# Altium schematic sheet 5_MOTORES_DE_PASSO.SchDoc
size Tabloid; SheetNumber: 5; SheetTotal: 5; SPICEModelCacheVFRLFGQA: <root> / <DocumentId>VFRLFGQA</DocumentId> / <CacheFrame Number="0"> / <Model Name="0603_885012206121_330nf" Kind="CKT"> / <Text>******* / .subckt 0603_885012206121_330nF 1 2 / Rser 1 3 0.0116331902783 / Lser 2 4 2.98906197E-10 / C1 3 4 0.00000033 / Rpar 3 4 1500000000 / .ends 0603_885012206121_330nF</Text> / </Model> / <Model Name="865080645012_47uf" Kind="CKT"> / <Text>******* / .subckt 865080645012_47uF 1 2 / Rser 1 3 0.49 / Lser 2 4 0.000000002503 / C1 3 4 0.000047 / Rpar 3 4 2127659.57446809 / .ends 865080645012_47uF</Text> / </Model> / </CacheFrame> / </root>
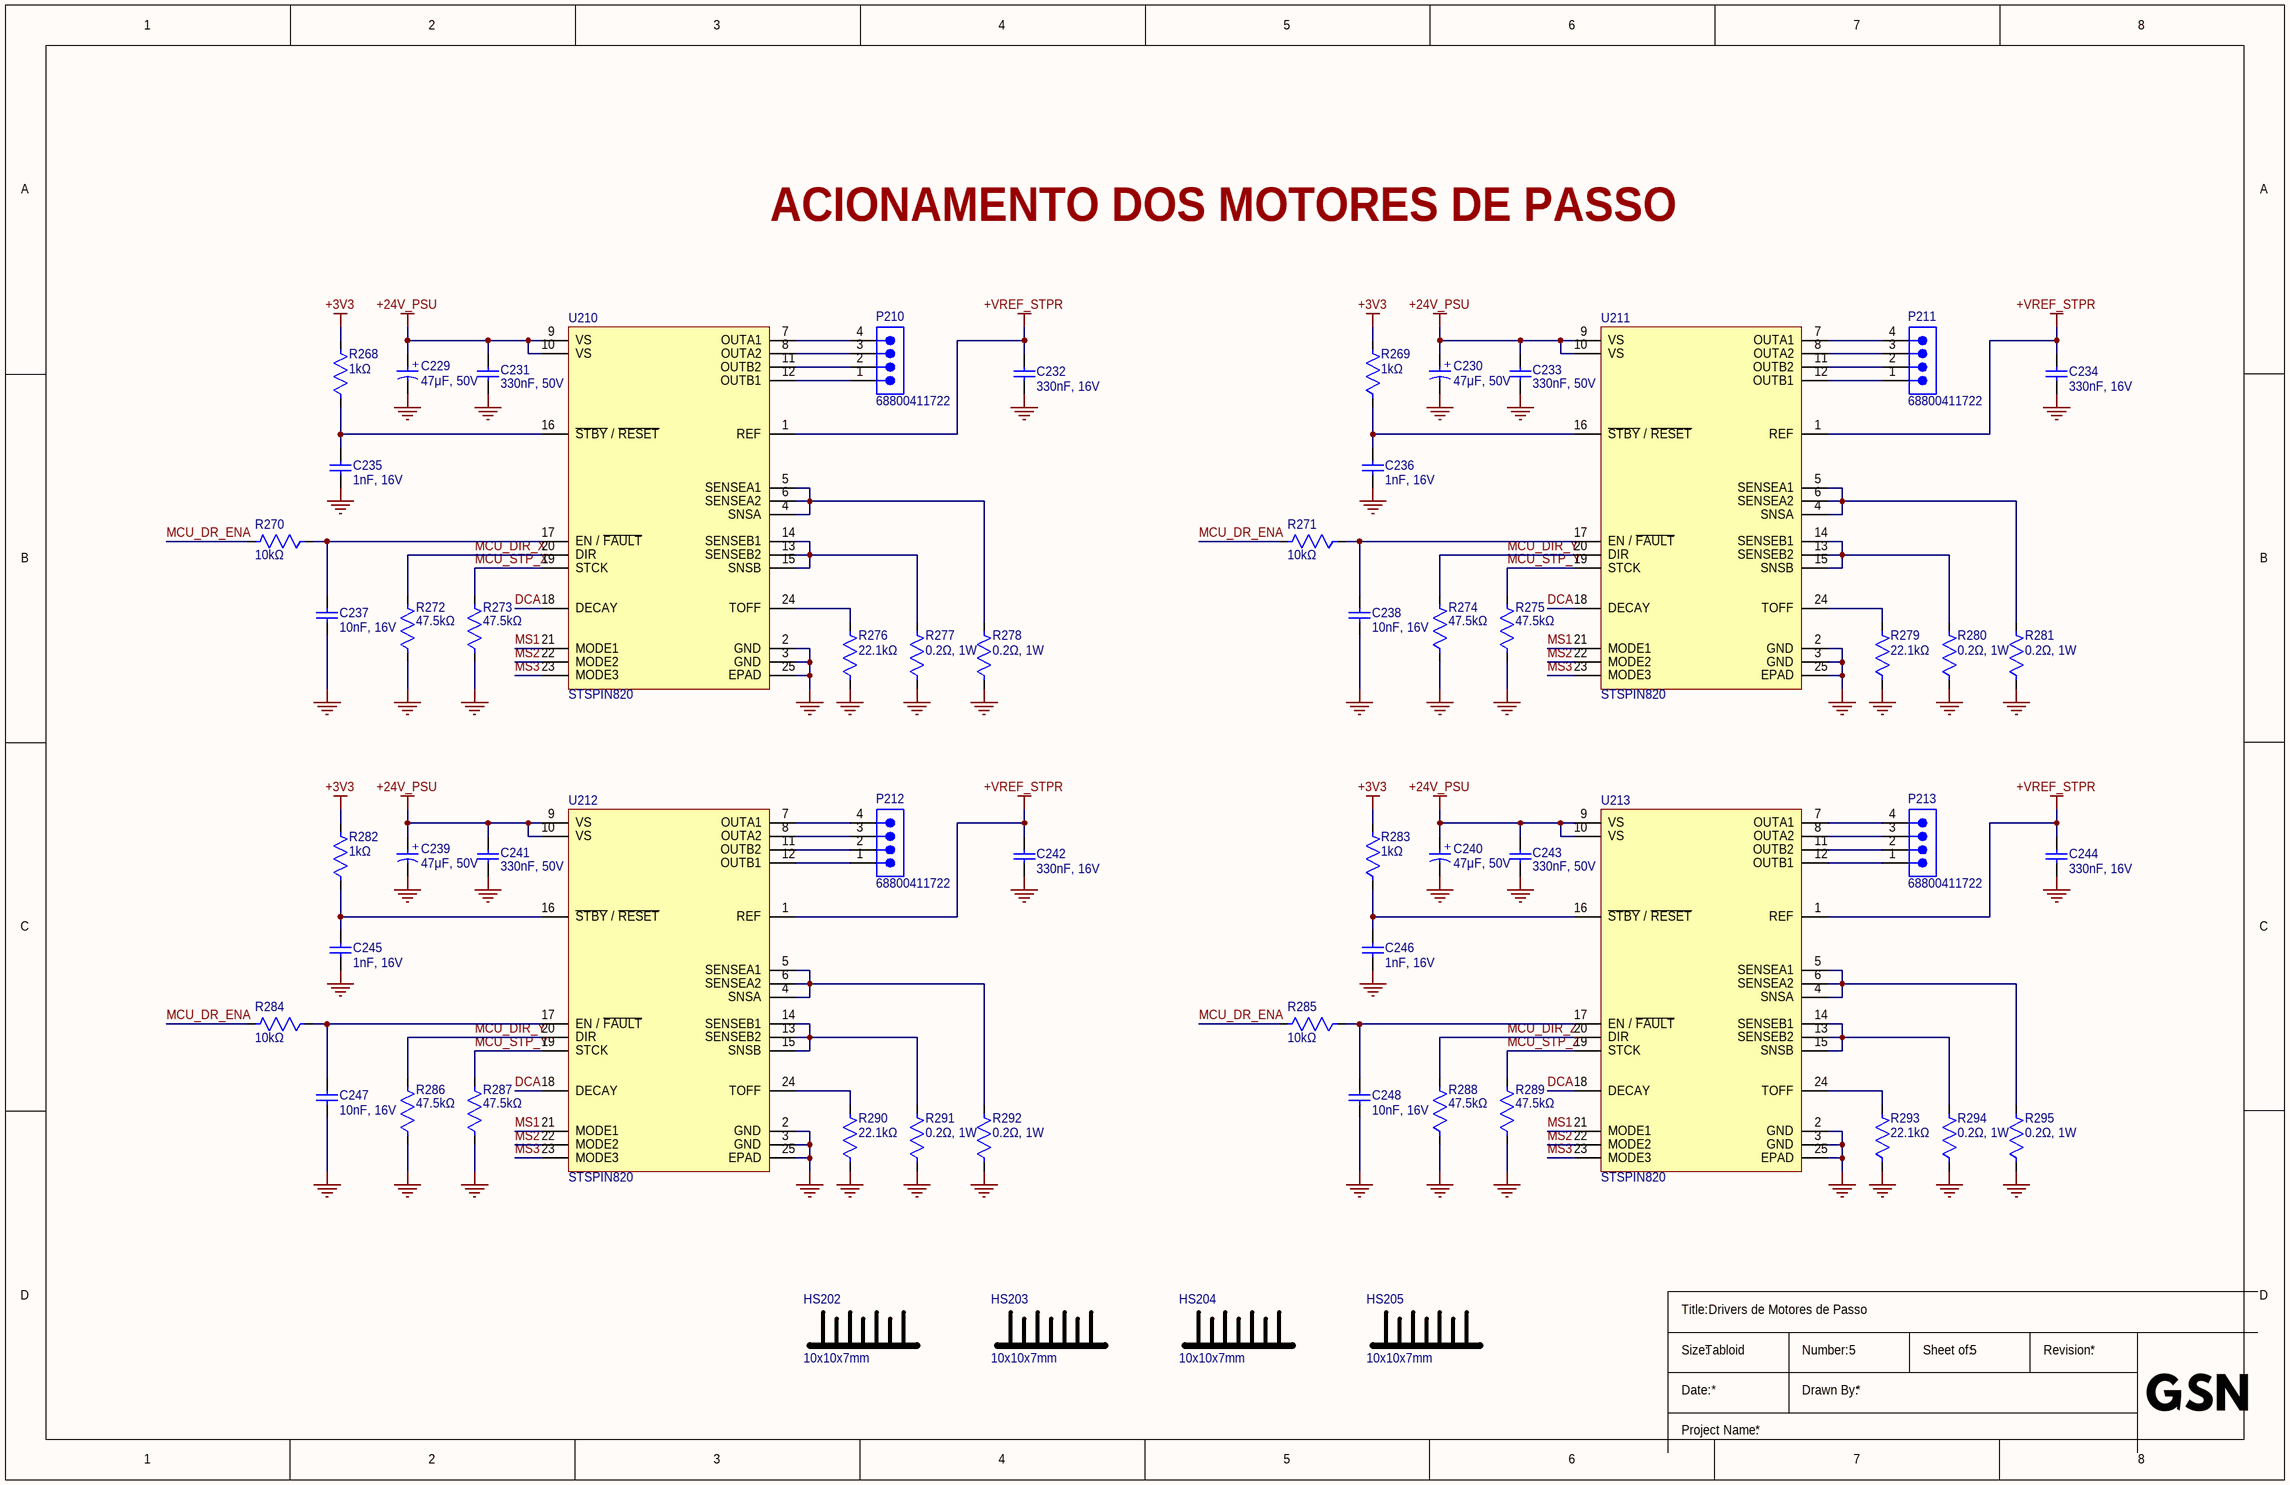
[diagram p0: 5_MOTORES_DE_PASSO.SchDoc]

## Parts
C229  47μF, 50V  [WCAP-ASLI_D6.3H7.7]
C230  47μF, 50V  [WCAP-ASLI_D6.3H7.7]
C231  330nF, 50V  [WCAP-CSGP_0603_L1.6W0.8H0.8_Wave]
C232  330nF, 16V  [WCAP-CSGP_0603_L1.6W0.8H0.8_Wave]
C233  330nF, 50V  [WCAP-CSGP_0603_L1.6W0.8H0.8_Wave]
C234  330nF, 16V  [WCAP-CSGP_0603_L1.6W0.8H0.8_Wave]
C235  1nF, 16V  [WCAP-CSGP_0603_L1.6W0.8H0.8_Wave]
C236  1nF, 16V  [WCAP-CSGP_0603_L1.6W0.8H0.8_Wave]
C237  10nF, 16V  [WCAP-CSGP_0603_L1.6W0.8H0.8_Wave]
C238  10nF, 16V  [WCAP-CSGP_0603_L1.6W0.8H0.8_Wave]
C239  47μF, 50V  [WCAP-ASLI_D6.3H7.7]
C240  47μF, 50V  [WCAP-ASLI_D6.3H7.7]
C241  330nF, 50V  [WCAP-CSGP_0603_L1.6W0.8H0.8_Wave]
C242  330nF, 16V  [WCAP-CSGP_0603_L1.6W0.8H0.8_Wave]
C243  330nF, 50V  [WCAP-CSGP_0603_L1.6W0.8H0.8_Wave]
C244  330nF, 16V  [WCAP-CSGP_0603_L1.6W0.8H0.8_Wave]
C245  1nF, 16V  [WCAP-CSGP_0603_L1.6W0.8H0.8_Wave]
C246  1nF, 16V  [WCAP-CSGP_0603_L1.6W0.8H0.8_Wave]
C247  10nF, 16V  [WCAP-CSGP_0603_L1.6W0.8H0.8_Wave]
C248  10nF, 16V  [WCAP-CSGP_0603_L1.6W0.8H0.8_Wave]
HS202  10x10x7mm  [HEATSINK_10MM_10MM_7MM]
HS203  10x10x7mm  [HEATSINK_10MM_10MM_7MM]
HS204  10x10x7mm  [HEATSINK_10MM_10MM_7MM]
HS205  10x10x7mm  [HEATSINK_10MM_10MM_7MM]
P210  68800411722  [68800411722]
P211  68800411722  [68800411722]
P212  68800411722  [68800411722]
P213  68800411722  [68800411722]
R268  1kΩ  [0603-WAVE]
R269  1kΩ  [0603-WAVE]
R270  10kΩ  [0603-WAVE]
R271  10kΩ  [0603-WAVE]
R272  47.5kΩ  [0603-WAVE]
R273  47.5kΩ  [0603-WAVE]
R274  47.5kΩ  [0603-WAVE]
R275  47.5kΩ  [0603-WAVE]
R276  22.1kΩ  [0603-WAVE]
R277  0.2Ω, 1W  [2512-WAVE]
R278  0.2Ω, 1W  [2512-WAVE]
R279  22.1kΩ  [0603-WAVE]
R280  0.2Ω, 1W  [2512-WAVE]
R281  0.2Ω, 1W  [2512-WAVE]
R282  1kΩ  [0603-WAVE]
R283  1kΩ  [0603-WAVE]
R284  10kΩ  [0603-WAVE]
R285  10kΩ  [0603-WAVE]
R286  47.5kΩ  [0603-WAVE]
R287  47.5kΩ  [0603-WAVE]
R288  47.5kΩ  [0603-WAVE]
R289  47.5kΩ  [0603-WAVE]
R290  22.1kΩ  [0603-WAVE]
R291  0.2Ω, 1W  [2512-WAVE]
R292  0.2Ω, 1W  [2512-WAVE]
R293  22.1kΩ  [0603-WAVE]
R294  0.2Ω, 1W  [2512-WAVE]
R295  0.2Ω, 1W  [2512-WAVE]
U210  STSPIN820  [24-TQFPN]
U211  STSPIN820  [24-TQFPN]
U212  STSPIN820  [24-TQFPN]
U213  STSPIN820  [24-TQFPN]

## Nets
+3V3: R268.2 R269.2 R282.2 R283.2
+24V_PSU: C229.1(P) C230.1(P) C231.2 C233.2 C239.1(P) C240.1(P) C241.2 C243.2 U210.9(VS) U210.10(VS) U211.9(VS) U211.10(VS) U212.9(VS) U212.10(VS) U213.9(VS) U213.10(VS)
+VREF_STPR: C232.2 C234.2 C242.2 C244.2 U210.1(REF) U211.1(REF) U212.1(REF) U213.1(REF)
GND: C229.2(N) C230.2(N) C231.1 C232.1 C233.1 C234.1 C235.1 C236.1 C237.1 C238.1 C239.2(N) C240.2(N) C241.1 C242.1 C243.1 C244.1 C245.1 C246.1 C247.1 C248.1 R272.1 R273.1 R274.1 R275.1 R276.1 R277.1 R278.1 R279.1 R280.1 R281.1 R286.1 R287.1 R288.1 R289.1 R290.1 R291.1 R292.1 R293.1 R294.1 R295.1 U210.2(GND) U210.3(GND) U210.25(EPAD) U211.2(GND) U211.3(GND) U211.25(EPAD) U212.2(GND) U212.3(GND) U212.25(EPAD) U213.2(GND) U213.3(GND) U213.25(EPAD)
DCA: U210.18(DECAY) U211.18(DECAY) U212.18(DECAY) U213.18(DECAY)
MCU_DIR_X: R272.2 U210.20(DIR)
MCU_DIR_Y: R274.2 R286.2 U211.20(DIR) U212.20(DIR)
MCU_DIR_Z: R288.2 U213.20(DIR)
MCU_DR_ENA: R270.2 R271.2 R284.2 R285.2
MCU_STP_X: R273.2 U210.19(STCK)
MCU_STP_Y: R275.2 R287.2 U211.19(STCK) U212.19(STCK)
MCU_STP_Z: R289.2 U213.19(STCK)
MS1: U210.21(MODE1) U211.21(MODE1) U212.21(MODE1) U213.21(MODE1)
MS2: U210.22(MODE2) U211.22(MODE2) U212.22(MODE2) U213.22(MODE2)
MS3: U210.23(MODE3) U211.23(MODE3) U212.23(MODE3) U213.23(MODE3)
NetC235_2: C235.2 R268.1 U210.16(~{STBY}_/_~{RESET})
NetC236_2: C236.2 R269.1 U211.16(~{STBY}_/_~{RESET})
NetC237_2: C237.2 R270.1 U210.17(EN_/_~{FAULT})
NetC238_2: C238.2 R271.1 U211.17(EN_/_~{FAULT})
NetC245_2: C245.2 R282.1 U212.16(~{STBY}_/_~{RESET})
NetC246_2: C246.2 R283.1 U213.16(~{STBY}_/_~{RESET})
NetC247_2: C247.2 R284.1 U212.17(EN_/_~{FAULT})
NetC248_2: C248.2 R285.1 U213.17(EN_/_~{FAULT})
NetP210_1: P210.1 U210.12(OUTB1)
NetP210_2: P210.2 U210.11(OUTB2)
NetP210_3: P210.3 U210.8(OUTA2)
NetP210_4: P210.4 U210.7(OUTA1)
NetP211_1: P211.1 U211.12(OUTB1)
NetP211_2: P211.2 U211.11(OUTB2)
NetP211_3: P211.3 U211.8(OUTA2)
NetP211_4: P211.4 U211.7(OUTA1)
NetP212_1: P212.1 U212.12(OUTB1)
NetP212_2: P212.2 U212.11(OUTB2)
NetP212_3: P212.3 U212.8(OUTA2)
NetP212_4: P212.4 U212.7(OUTA1)
NetP213_1: P213.1 U213.12(OUTB1)
NetP213_2: P213.2 U213.11(OUTB2)
NetP213_3: P213.3 U213.8(OUTA2)
NetP213_4: P213.4 U213.7(OUTA1)
NetR276_2: R276.2 U210.24(TOFF)
NetR277_2: R277.2 U210.13(SENSEB2) U210.14(SENSEB1) U210.15(SNSB)
NetR278_2: R278.2 U210.4(SNSA) U210.5(SENSEA1) U210.6(SENSEA2)
NetR279_2: R279.2 U211.24(TOFF)
NetR280_2: R280.2 U211.13(SENSEB2) U211.14(SENSEB1) U211.15(SNSB)
NetR281_2: R281.2 U211.4(SNSA) U211.5(SENSEA1) U211.6(SENSEA2)
NetR290_2: R290.2 U212.24(TOFF)
NetR291_2: R291.2 U212.13(SENSEB2) U212.14(SENSEB1) U212.15(SNSB)
NetR292_2: R292.2 U212.4(SNSA) U212.5(SENSEA1) U212.6(SENSEA2)
NetR293_2: R293.2 U213.24(TOFF)
NetR294_2: R294.2 U213.13(SENSEB2) U213.14(SENSEB1) U213.15(SNSB)
NetR295_2: R295.2 U213.4(SNSA) U213.5(SENSEA1) U213.6(SENSEA2)

## Notes on the sheet
- ACIONAMENTO DOS MOTORES DE PASSO
- Drivers de Motores de Passo
- Title:
- Size:
- Tabloid
- Number:
- Sheet of:
- Revision:
- Date:
- Project Name:
- Drawn By:
- (in symbol 865080645012) +

## Library data of the parts
C229 C230 C239 C240 = 865080645012: WCAP-ASLI Aluminum Electrolytic Capacitor, V-Chip, SMT, 6.3mm x 7.7mm, 47μF, 50V; Manufacturer: Wurth Elektronik; Capacitance: 47uF; Dissipation Factor: 12%; Endurance: 2000h; Impedance: 700mohm; Leakage Current: 23.5uA; Ripple Current: 230mA; Manufacturer Part Number: 865080645012; Category: Aluminum Electrolytic Capacitors; Match Code: WCAP-ASLI; ComponentLink1Description: Website Link; ComponentLink1URL: https://www.we-online.com/redexpert/article/865080645012?ad; ComponentLink2Description: Datasheet Link; ComponentLink2URL: https://www.we-online.com/redexpert/spec/865080645012?ad; Mount: Surface Mount; Operating Temperature Min: -55degC; Operating Temperature Max: 105degC; Packaging: Tape and Reel; Height: 7.7mm; Diameter: 6.3mm; Rated Voltage (DC): 50V
C231 C233 C241 C243 = 885012206121: WCAP-CSGP Multilayer Ceramic Chip Capacitor, General Purpose, size 0603, 330nF, 50V; Manufacturer: Wurth Elektronik; Case/Size Code: 0603; Capacitance Tolerance: +/-10%; Ceramic Type: X7R; Dissipation Factor: 10%; Insulation Resistance: 1.5GΩ; Technical Reference: X7R0603334K050DFCT10000; Manufacturer Part Number: 885012206121; Category: Multilayer Ceramic Chip Capacitors; Match Code: WCAP-CSGP; ComponentLink1Description: Website Link; ComponentLink1URL: https://www.we-online.com/redexpert/article/885012206121?ad; ComponentLink2Description: Datasheet Link; ComponentLink2URL: https://www.we-online.com/redexpert/spec/885012206121?ad; Mount: Surface Mount; Min Operating Temperature: -55°C; Max Operating Temperature: 125°C; Packaging: Tape and Reel; Length: 1.6mm; Width: 0.8mm; Height: 0.8mm; Capacitance: 330nF; Rated Voltage (DC): 50V
C232 C234 C242 C244 = 885012206049: WCAP-CSGP Multilayer Ceramic Chip Capacitor, General Purpose, size 0603, 330nF, 16V; Manufacturer: Wurth Elektronik; Case/Size Code: 0603; Capacitance Tolerance: +/-10%; Ceramic Type: X7R; Dissipation Factor: 5%; Insulation Resistance: 1.5Gohm; Technical Reference: X7R0603334K016DFCT10000; Manufacturer Part Number: 885012206049; Category: Multilayer Ceramic Chip Capacitors; Match Code: WCAP-CSGP; ComponentLink1Description: Website Link; ComponentLink1URL: https://www.we-online.com/redexpert/article/885012206049?ad; ComponentLink2Description: Datasheet Link; ComponentLink2URL: https://www.we-online.com/redexpert/spec/885012206049?ad; Mount: Surface Mount; Operating Temperature Min: -55degC; Operating Temperature Max: 125degC; Packaging: Tape and Reel; Length: 1.6mm; Width: 0.8mm; Height: 0.8mm; Capacitance: 330nF; Rated Voltage (DC): 16V
C235 C236 C245 C246 = 885012206034: WCAP-CSGP Multilayer Ceramic Chip Capacitor, General Purpose, size 0603, 1nF, 16V; Manufacturer: Wurth Elektronik; Case/Size Code: 0603; Capacitance Tolerance: +/-10%; Ceramic Type: X7R; Dissipation Factor: 3.5%; Insulation Resistance: 10Gohm; Technical Reference: X7R0603102K016DFCT10000; Manufacturer Part Number: 885012206034; Category: Multilayer Ceramic Chip Capacitors; Match Code: WCAP-CSGP; ComponentLink1Description: Website Link; ComponentLink1URL: https://www.we-online.com/redexpert/article/885012206034?ad; ComponentLink2Description: Datasheet Link; ComponentLink2URL: https://www.we-online.com/redexpert/spec/885012206034?ad; Mount: Surface Mount; Operating Temperature Min: -55degC; Operating Temperature Max: 125degC; Packaging: Tape and Reel; Length: 1.6mm; Width: 0.8mm; Height: 0.8mm; Capacitance: 1nF; Rated Voltage (DC): 16V
C237 C238 C247 C248 = 885012206040: WCAP-CSGP Multilayer Ceramic Chip Capacitor, General Purpose, size 0603, 10nF, 16V; Manufacturer: Wurth Elektronik; Case/Size Code: 0603; Capacitance Tolerance: +/-10%; Ceramic Type: X7R; Dissipation Factor: 3.5%; Insulation Resistance: 10Gohm; Technical Reference: X7R0603103K016DFCT10000; Manufacturer Part Number: 885012206040; Category: Multilayer Ceramic Chip Capacitors; Match Code: WCAP-CSGP; ComponentLink1Description: Website Link; ComponentLink1URL: https://www.we-online.com/redexpert/article/885012206040?ad; ComponentLink2Description: Datasheet Link; ComponentLink2URL: https://www.we-online.com/redexpert/spec/885012206040?ad; Mount: Surface Mount; Operating Temperature Min: -55degC; Operating Temperature Max: 125degC; Packaging: Tape and Reel; Length: 1.6mm; Width: 0.8mm; Height: 0.8mm; Capacitance: 10nF; Rated Voltage (DC): 16V
HS202-HS205 = GENERIC-HEATSINK-10X10X7MM: GENERIC HEATSINK 10X10X7MM; Manufacturer: OEM; Manufacturer Part Number: None
P210-P213 = 68800411722: WR-WTB “J” Type THT Male Horizontal Shrouded Header, pitch 2.5 mm, 4 pins; Manufacturer: Wurth Elektronik; Contact Resistance: 20 mohm; Rated Current: 3 A; Working Voltage: 250 V(AC); Withstanding Voltage: 800 V(AC); Manufacturer Part Number: 68800411722; Category: Wire-to-Board Connector; Match Code: WR-WTB; ComponentLink1Description: Website Link; ComponentLink1URL: https://www.we-online.com/redexpert/article/68800411722?ad; ComponentLink2Description: Datasheet Link; ComponentLink2URL: https://www.we-online.com/redexpert/spec/68800411722?ad; Mount: Through Hole; Operating Temperature Min: -25degC; Operating Temperature Max: 85degC; Packaging: Bag; Length: 12.5 mm; Width: 8.3 mm; Height: 4.2 mm; Gender: Male; Number of Pins: 4; Number of Rows: 1; Orientation: Horizontal; Lead Pitch: 2.5 mm
R268 R269 R282 R283 = RC0603FR-071KL: RES 1K OHM 1% 1/10W 0603; Manufacturer: Yageo Group; Max Power Dissipation: 100mW; Temperature Coefficient: ±200ppm/°C; Voltage Rating (AC): 50V; Voltage Rating: 75V; Supplier Part Number: 311-1.00KHRCT-ND; Manufacturer Part Number: RC0603FR-071KL; Value: 1kΩ; Case Code (Imperial): 0603; Case Code (Metric): 1608; Case/Package: 0603; Category: Chip SMD Resistors; China RoHS: Non-Compliant; Composition: Thick Film; Contact Plating: Tin; Depth: 800µm; Features: Moisture Resistant; Height: 450µm; Lead Free: Lead Free; Length: 1.6mm; Lifecycle Status: Production; Max Operating Temperature: 155°C; Military Standard: Not; Min Operating Temperature: -55°C; Mounting Technology: Surface Mount; Number of Terminals: 2; Number of Terminations: 2; Packaging: Tape & Reel; Power Dissipation: 100mW; Power Rating: 100mW; Radiation Hardening: No; REACH SVHC: Yes; RoHS: Compliant; Supplier: DigiKey; Termination: SMD/SMT; Tolerance: 1%; Component Link Description: https://www.yageogroup.com/content/datasheet/asset/file/PYU-RC_GROUP_51_ROHS_L; Component Link URL: https://www.yageogroup.com/content/datasheet/asset/file/PYU-RC_GROUP_51_ROHS_L; Datasheet: https://www.yageogroup.com/content/datasheet/asset/file/PYU-RC_GROUP_51_ROHS_L; Voltage Rating (DC): 50V; Weight: 2.012816mg; Width: 800µm; Working Voltage: 75V
R270 R271 R284 R285 = RC0603FR-0710KL: RES 10K OHM 1% 1/10W 0603; Manufacturer: Yageo Group; Max Power Dissipation: 100mW; Temperature Coefficient: ±200ppm/°C; Voltage Rating (AC): 50V; Voltage Rating: 75V; Supplier Part Number: 311-10.0KHRCT-ND; Manufacturer Part Number: RC0603FR-0710KL; Value: 10kΩ; Case Code (Imperial): 0603; Case Code (Metric): 1608; Case/Package: 0603; Category: Chip SMD Resistors; China RoHS: Non-Compliant; Composition: Thick Film; Contact Plating: Tin; Depth: 800µm; Features: Moisture Resistant; Height: 450µm; Lead Free: Lead Free; Length: 1.6mm; Lifecycle Status: Production; Max Operating Temperature: 155°C; Military Standard: Not; Min Operating Temperature: -55°C; Mounting Technology: Surface Mount; Number of Terminals: 2; Number of Terminations: 2; Packaging: Tape & Reel; Power Dissipation: 100mW; Power Rating: 100mW; Radiation Hardening: No; REACH SVHC: Yes; RoHS: Compliant; Supplier: DigiKey; Termination: SMD/SMT; Tolerance: 1%; Component Link Description: https://www.yageogroup.com/content/datasheet/asset/file/PYU-RC_GROUP_51_ROHS_L; Component Link URL: https://www.yageogroup.com/content/datasheet/asset/file/PYU-RC_GROUP_51_ROHS_L; Datasheet: https://www.yageogroup.com/content/datasheet/asset/file/PYU-RC_GROUP_51_ROHS_L; Voltage Rating (DC): 50V; Weight: 2.012816mg; Width: 800µm; Working Voltage: 75V
R272-R275 R286-R289 = RC0603FR-0747K5L: RES 47.5K OHM 1% 1/10W 0603; Manufacturer: Yageo Group; Max Power Dissipation: 100mW; Temperature Coefficient: ±200ppm/°C; Voltage Rating (AC): 50V; Voltage Rating: 75V; Supplier Part Number: 311-47.5KHRCT-ND; Manufacturer Part Number: RC0603FR-0747K5L; Value: 47.5kΩ; Case Code (Imperial): 0603; Case Code (Metric): 1608; Case/Package: 0603; Category: Chip SMD Resistors; China RoHS: Non-Compliant; Composition: Thick Film; Contact Plating: Tin; Depth: 800µm; Features: Moisture Resistant; Height: 450µm; Lead Free: Lead Free; Length: 1.6mm; Lifecycle Status: Production; Max Operating Temperature: 155°C; Military Standard: Not; Min Operating Temperature: -55°C; Mounting Technology: Surface Mount; Number of Terminals: 2; Number of Terminations: 2; Packaging: Tape & Reel; Power Dissipation: 100mW; Power Rating: 100mW; Radiation Hardening: No; REACH SVHC: Yes; RoHS: Compliant; Supplier: DigiKey; Termination: SMD/SMT; Tolerance: 1%; Component Link Description: https://www.yageogroup.com/content/datasheet/asset/file/PYU-RC_GROUP_51_ROHS_L; Component Link URL: https://www.yageogroup.com/content/datasheet/asset/file/PYU-RC_GROUP_51_ROHS_L; Datasheet: https://www.yageogroup.com/content/datasheet/asset/file/PYU-RC_GROUP_51_ROHS_L; Voltage Rating (DC): 50V; Weight: 2.012816mg; Width: 800µm; Working Voltage: 75V
R276 R279 R290 R293 = RC0603FR-0722K1L: RES 22.1K OHM 1% 1/10W 0603; Manufacturer: Yageo Group; Max Power Dissipation: 100mW; Temperature Coefficient: ±200ppm/°C; Voltage Rating (AC): 50V; Voltage Rating: 75V; Supplier Part Number: 311-22.1KHRCT-ND; Manufacturer Part Number: RC0603FR-0722K1L; Value: 22.1kΩ; Case Code (Imperial): 0603; Case Code (Metric): 1608; Case/Package: 0603; Category: Chip SMD Resistors; China RoHS: Non-Compliant; Composition: Thick Film; Contact Plating: Tin; Depth: 800µm; Features: Moisture Resistant; Height: 450µm; Lead Free: Lead Free; Length: 1.6mm; Lifecycle Status: Production; Max Operating Temperature: 155°C; Military Standard: Not; Min Operating Temperature: -55°C; Mounting Technology: Surface Mount; Number of Terminals: 2; Number of Terminations: 2; Packaging: Tape & Reel; Power Dissipation: 100mW; Power Rating: 100mW; Radiation Hardening: No; REACH SVHC: Yes; RoHS: Compliant; Supplier: DigiKey; Termination: SMD/SMT; Tolerance: 1%; Component Link Description: https://www.yageogroup.com/content/datasheet/asset/file/PYU-RC_GROUP_51_ROHS_L; Component Link URL: https://www.yageogroup.com/content/datasheet/asset/file/PYU-RC_GROUP_51_ROHS_L; Datasheet: https://www.yageogroup.com/content/datasheet/asset/file/PYU-RC_GROUP_51_ROHS_L; Voltage Rating (DC): 50V; Weight: 2.012816mg; Width: 800µm; Working Voltage: 75V
R277 R278 R280 R281 R291 R292 R294 R295 = RL2512FK-070R2L: RES 0.2 OHM 1% 1W 2512; Manufacturer: Yageo Group; Value: 200mΩ; Temperature Coefficient: 600ppm/°C; Working Voltage: 447.2mV; Supplier: DigiKey; Supplier Part Number: 311-0.2TCT-ND; Manufacturer Part Number: RL2512FK-070R2L; RoHS: Compliant; Category: Chip SMD Resistors; Stock: 22890; Pricing: 1=0.44, 10=0.249, 25=0.206, 50=0.1814, 100=0.1618, 250=0.142, 500=0.13056, 1000=0.12148 (USD); Case/Package: 2512; Case Code (Imperial): 2512; Case Code (Metric): 6332; China RoHS: Non-Compliant; Composition: Thick Film; Contact Plating: Lead, Tin; Country of Origin: Mainland China, Taiwan; Depth: 3.2mm; Export Control Classification Number (ECCN) Code: EAR99; Height: 550µm; Harmonized Tariff Schedule (HTS) Code: 8533.21.00.30; Introduction Date: 2005-04-15; Lead Free: Lead Free; Length: 6.35mm; Lifecycle Status: Production; Max Operating Temperature: 155°C; Military Standard: Not; Min Operating Temperature: -55°C; Mounting Technology: Surface Mount; Number of Terminals: 2; Power Rating: 1W; Ratings: AEC-Q200; REACH SVHC: Yes; Schedule B: 8533210045, 8533210045|8533210045, 8533210045|8533210045|8533210045, 8533210045|8533210045|8533210045|8533210045; Termination: SMD/SMT; Tolerance: 1%; Weight: 40.511469mg; Width: 3.2mm; ComponentLink1URL: https://datasheet.octopart.com:443/RL2512FK-070R2L-Yageo-datasheet-182189623.pdf?src-supplier=IHS; ComponentLink1Description: https://datasheet.octopart.com:443/RL2512FK-070R2L-Yageo-datasheet-182189623.pdf?src-supplier=IHS; ComponentLink2URL: https://datasheet.octopart.com:443/RL2512FK-070R2L-Yageo-datasheet-83209227.pdf?src-supplier=LCSC; ComponentLink2Description: https://datasheet.octopart.com:443/RL2512FK-070R2L-Yageo-datasheet-83209227.pdf?src-supplier=LCSC; ComponentLink3URL: https://datasheet.octopart.com:443/RL2512FK-070R2L-Yageo-Group-datasheet-178203169.pdf?src-supplier=Future+Electronics; ComponentLink3Description: https://datasheet.octopart.com:443/RL2512FK-070R2L-Yageo-Group-datasheet-178203169.pdf?src-supplier=Future+Electronics; ComponentLink4URL: https://datasheet.octopart.com:443/RL2512FK-070R2L-Yageo-datasheet-137700928.pdf?src-supplier=Future+Electronics; ComponentLink4Description: https://datasheet.octopart.com:443/RL2512FK-070R2L-Yageo-datasheet-137700928.pdf?src-supplier=Future+Electronics; ComponentLink5URL: https://datasheet.octopart.com:443/RL2512FK-070R2L-Yageo-datasheet-42224166.pdf?src-supplier=Future+Electronics; ComponentLink5Description: https://datasheet.octopart.com:443/RL2512FK-070R2L-Yageo-datasheet-42224166.pdf?src-supplier=Future+Electronics; ComponentLink6URL: https://datasheet.octopart.com:443/RL2512FK-070R2L-Yageo-datasheet-21255488.pdf?src-supplier=Future+Electronics; ComponentLink6Description: https://datasheet.octopart.com:443/RL2512FK-070R2L-Yageo-datasheet-21255488.pdf?src-supplier=Future+Electronics; ComponentLink7URL: https://datasheet.octopart.com:443/RL2512FK-070R2L-Yageo-datasheet-12526708.pdf?src-supplier=Future+Electronics; ComponentLink7Description: https://datasheet.octopart.com:443/RL2512FK-070R2L-Yageo-datasheet-12526708.pdf?src-supplier=Future+Electronics; ComponentLink8URL: https://datasheet.octopart.com:443/RL2512FK-070R2L-Yageo-datasheet-12521612.pdf?src-supplier=Future+Electronics; ComponentLink8Description: https://datasheet.octopart.com:443/RL2512FK-070R2L-Yageo-datasheet-12521612.pdf?src-supplier=Future+Electronics; ComponentLink9URL: https://datasheet.octopart.com/RL2512FK-070R2L-Yageo-datasheet-10916029.pdf; ComponentLink9Description: https://datasheet.octopart.com/RL2512FK-070R2L-Yageo-datasheet-10916029.pdf; ComponentLink10URL: http://sigma.octopart.com:80/conflict_mineral_statement/Yageo-company-3.pdf?src-supplier=Compliance+Statements; ComponentLink10Description: http://sigma.octopart.com:80/conflict_mineral_statement/Yageo-company-3.pdf?src-supplier=Compliance+Statements; ComponentLink11URL: http://sigma.octopart.com:80/rohs_statement/Yageo-company-2.pdf?src-supplier=Compliance+Statements; ComponentLink11Description: http://sigma.octopart.com:80/rohs_statement/Yageo-company-2.pdf?src-supplier=Compliance+Statements
U210-U213 = STSPIN820: IC MTR DRVR BIPLR 7-45V 24TFQFPN; Manufacturer: STMicroelectronics; Throw Configuration: STEPPER MOTOR CONTROLLER; Supplier: Digikey; Supplier Part Number: 497-17713-1-ND; Manufacturer Part Number: STSPIN820; RoHS: Yes; Category: Motor Drives; Stock: 11767; Pricing: 1=3.03, 10=2.271, 25=2.0804, 100=1.8709, 250=1.77096, 500=1.71068, 1000=1.66108 (USD); Reach SVHC Compliant: Yes; RoHS Compliant: Yes; ComponentLink1URL: https://datasheet.ciiva.com:443/pdfs/VipMasterIC/IC/SGST/SGST-S-A0005002811/SGST-S-A0005002811-1.pdf?src-supplier=IHS+Markit; ComponentLink1Description: https://datasheet.ciiva.com:443/pdfs/VipMasterIC/IC/SGST/SGST-S-A0005002811/SGST-S-A0005002811-1.pdf?src-supplier=IHS+Markit; ComponentLink2URL: http://www.farnell.com/datasheets/2549178.pdf?src-supplier=Farnell; ComponentLink2Description: http://www.farnell.com/datasheets/2549178.pdf?src-supplier=Farnell; ComponentLink3URL: http://www.st.com/content/ccc/resource/technical/document/datasheet/group3/64/0a/8b/fb/e5/29/46/34/DM00436631/files/DM00436631.pdf/jcr:content/translations/en.DM00436631.pdf?src-supplier=Digikey; ComponentLink3Description: http://www.st.com/content/ccc/resource/technical/document/datasheet/group3/64/0a/8b/fb/e5/29/46/34/DM00436631/files/DM00436631.pdf/jcr:content/translations/en.DM00436631.pdf?src-supplier=Digikey; ComponentLink4URL: https://datasheet.octopart.com/STSPIN820-STMicroelectronics-datasheet-99887157.pdf?src-supplier=Newark; ComponentLink4Description: https://datasheet.octopart.com/STSPIN820-STMicroelectronics-datasheet-99887157.pdf?src-supplier=Newark; ComponentLink5URL: http://www.farnell.com/datasheets/2549178.pdf?src-supplier=Newark; ComponentLink5Description: http://www.farnell.com/datasheets/2549178.pdf?src-supplier=Newark; ComponentLink6URL: https://datasheet.octopart.com/STSPIN820-STMicroelectronics-datasheet-163660309.pdf?src-supplier=SHENGYU+ELECTRONICS; ComponentLink6Description: https://datasheet.octopart.com/STSPIN820-STMicroelectronics-datasheet-163660309.pdf?src-supplier=SHENGYU+ELECTRONICS